# EAGLE design controller (EAGLE 9.6.2)
AUTHOR: Douglas Hutchings; REVISION: C
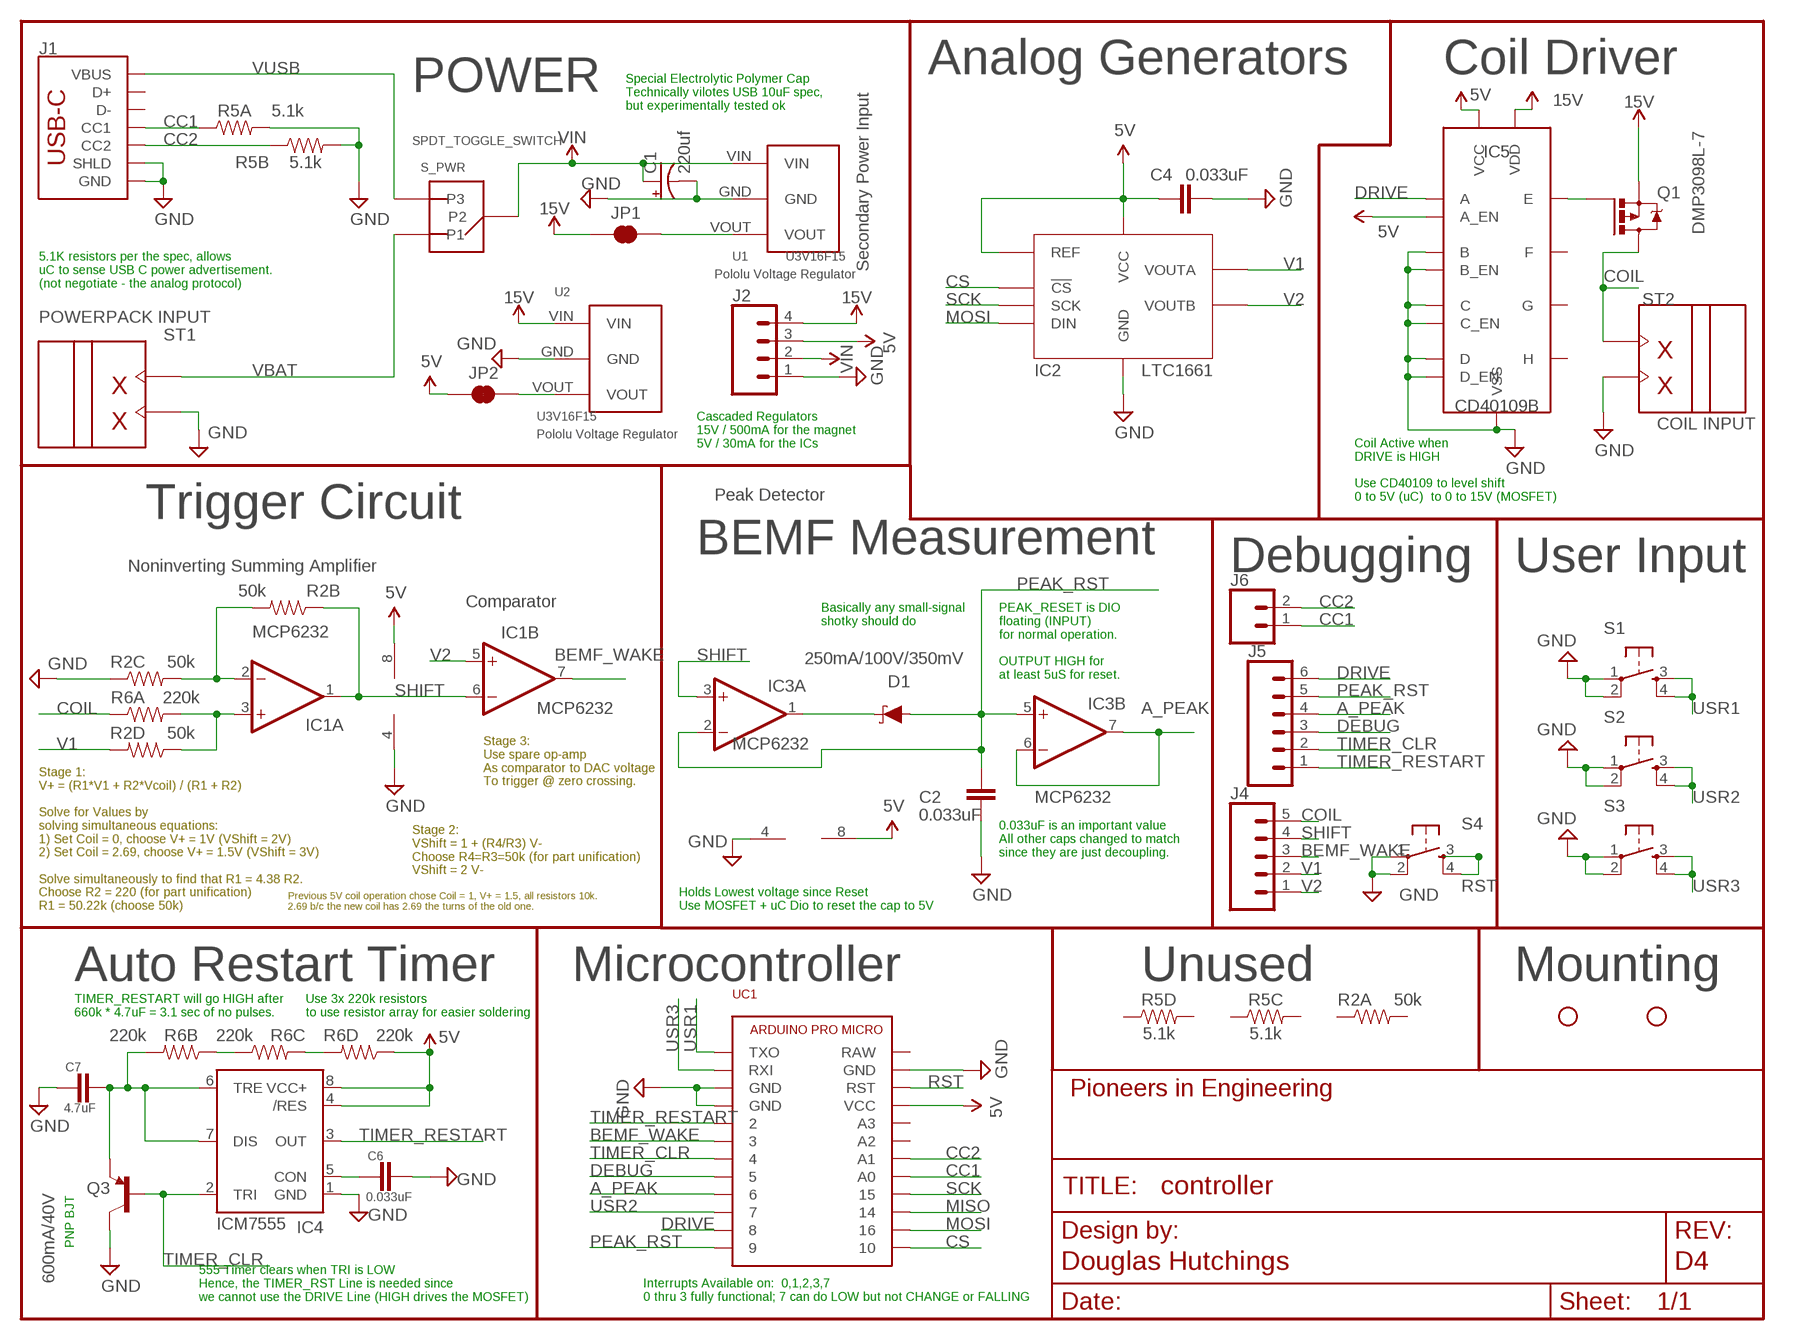
[diagram p0: schematic, sheet 1]
FRAME1 (FRAME_SCHEMATIC): REVISION: D4

## Parts
C1  220uf  CPOL-USE2.5-7  [E2,5-7]
C2  0.033uF  CAP0603-CAP  [0603-CAP]
C4  0.033uF  CAP0603-CAP  [0603-CAP]
C6  0.033uF  CAP0603-CAP  [0603-CAP]
C7  4.7uF  CAP0603-CAP  [0603-CAP]
D1  250mA/100V/350mV  DIODE-SCHOTTKY-BAT60A  [SOD-323]
IC1  MCP6232  MCP602SN  [SO08]
IC2  LTC1661MSOP8  [SOP65P490X110-8N]
IC3  MCP6232  MCP602SN  [SO08]
IC4  ICM7555  555D  [SO08]
IC5  CD40109B  CD40109BTSSOP16  [SOP65P640X120-16N]
J1  USB_C_2-LAYER_PADS  [USB-C-16P-2LAYER-PADS]
J2  CONN_041X04_NO_SILK  [1X04_NO_SILK]
J4  CONN_05NO_SILK  [1X05_NO_SILK]
J5  CONN_06NO_SILK_NO_POP  [1X06_NO_SILK]
J6  CONN_021X02_NO_SILK  [1X02_NO_SILK]
JP1  JUMPER-SMT_2_NC_TRACE_SILK  [SMT-JUMPER_2_NC_TRACE_SILK]
JP2  JUMPER-SMT_2_NC_TRACE_SILK  [SMT-JUMPER_2_NC_TRACE_SILK]
Q1  DMP3098  P-CHANNEL-MOSFETSOT23-3  [SOT23-3]
Q3  600mA/40V  TRANS_PNP-MMBT4403  [SOT23-3]
R2  50k  RESISTOR_ARRAY_(4)-1206-1/16W-5%  [1206_RA]
R5  5.1k  RESISTOR_ARRAY_(4)-1206-1/16W-5%  [1206_RA]
R6  220k  RESISTOR_ARRAY_(4)-1206-1/16W-5%  [1206_RA]
S1  TAC_SWITCHPTH  [TACTILE-PTH]
S2  TAC_SWITCHPTH  [TACTILE-PTH]
S3  TAC_SWITCHPTH  [TACTILE-PTH]
S4  TAC_SWITCHPTH  [TACTILE-PTH]
S_PWR  SPDT_TOGGLE_SWITCH  [E-SWITCH-SPDT]
ST1  2PIN_SCREW  [2PIN_SCREW]
ST2  2PIN_SCREW  [2PIN_SCREW]
STANDOFF1  STAND-OFFKEYSTONE_SMT_STANDOFF  [KEYSTONE-4881]
STANDOFF2  STAND-OFFKEYSTONE_SMT_STANDOFF  [KEYSTONE-4881]
U1  U3V16F15  POLOLU_VOLTAGE_REGULATOR_3PINBOOST  [POLOLU_VOLTAG_REGULATOR_U3V16FX_VERT]
U2  U3V16F15  POLOLU_VOLTAGE_REGULATOR_3PIN  [POLOLU_VOLTAG_REGULATOR_D45V1E1FX_VERT]
UC1  ARDUINO_PRO_MICROUSBC  [ARDUINO_PRO_MICRO_USBC]

## Nets
5V: C4.1 IC1.8(P:V+) IC2.4(REF) IC2.6(VCC) IC3.8(P:V+) IC4.4(/RES) IC4.8(VCC+) IC5.1(VCC) IC5.2(A_EN) J2.3 JP2.1 R6.P4 UC1.VCC
15V: IC5.16(VDD) J2.4 JP1.1 Q1.2(S) U2.VIN
A_PEAK: IC3.6(B:-IN) IC3.7(B:OUT) J5.4 UC1.6
BEMF_WAKE: IC1.7(B:OUT) J4.3 UC1.3
CC1: J1.A5(CC1) J6.1 R5.P1 UC1.A0
CC2: J1.B5(CC2) J6.2 R5.P2 UC1.A1
COIL: J4.5 Q1.3(D) R6.P1 ST2.P$2
CS: IC2.1(!CS) UC1.10
DEBUG: J5.3 UC1.5
DRIVE: IC5.3(A) J5.6 UC1.8
GND: C1.- C2.2 C4.2 C6.2 C7.1 IC1.4(P:V-) IC2.7(GND) IC3.4(P:V-) IC4.1(GND) IC5.6(B) IC5.7(B_EN) IC5.8(VSS) IC5.9(C_EN) IC5.10(C) IC5.14(D) IC5.15(D_EN) J1.GND J1.GND2(GND) J1.SHLD1(SHLD) J1.SHLD2(SHLD) J1.SHLD3(SHLD) J1.SHLD4(SHLD) J2.1 Q3.3(C) R2.P3 R5.P7 R5.P8 S1.1 S1.2 S2.1 S2.2 S3.1 S3.2 S4.1 S4.2 ST1.P$1 ST2.P$1 U1.GND U2.GND UC1.GND@0(GND) UC1.GND@1(GND) UC1.GND@2(GND)
MISO: UC1.14
MOSI: IC2.3(DIN) UC1.16
N$1: D1.C IC3.1(A:OUT)
N$3: R6.P2 R6.P3
N$4: IC1.3(A:+IN) R2.P4 R6.P8
N$5: IC1.2(A:-IN) R2.P6 R2.P7
N$6: C6.1 IC4.5(CON)
N$7: C7.2 IC4.6(TRE) IC4.7(DIS) Q3.2(E) R6.P7
N$8: JP1.2 U1.VOUT
N$9: JP2.2 U2.VOUT
N$10: R6.P5 R6.P6
N$11: IC5.4(E) Q1.1(G)
PEAK_RST: C2.1 D1.A IC3.2(A:-IN) IC3.5(B:+IN) J5.5 UC1.9
RST: S4.3 S4.4 UC1.RST
SCK: IC2.2(SCK) UC1.15
SHIFT: IC1.1(A:OUT) IC1.6(B:-IN) IC3.3(A:+IN) J4.4 R2.P2
TIMER_CLR: IC4.2(TRI) J5.2 Q3.1(B) UC1.4
TIMER_RESTART: IC4.3(OUT) J5.1 UC1.2
USR1: S1.3 S1.4 UC1.TXO
USR2: S2.3 S2.4 UC1.7
USR3: S3.3 S3.4 UC1.RXI
V1: IC2.8(VOUTA) J4.2 R2.P5
V2: IC1.5(B:+IN) IC2.5(VOUTB) J4.1
VBAT: S_PWR.P1 ST1.P$2
VIN: C1.+ J2.2 S_PWR.P2 U1.VIN
VUSB: J1.VBUS1(VBUS) J1.VBUS2(VBUS) S_PWR.P3
Unconnected: IC5.5(F) IC5.11(G) IC5.13(H) J1.A6(D+) J1.A7(D-) J1.B6(D+) J1.B7(D-) R2.P1 R2.P8 R5.P3 R5.P4 R5.P5 R5.P6 UC1.A2 UC1.A3 UC1.RAW

## Notes on the sheet
- Analog Generators | Coil Driver
- POWER | Secondary Power Input
- Special Electrolytic Polymer Cap
  Technically vilotes USB 10uF spec,
  but experimentally tested ok
- DMP3098L-7
- 5.1K resistors per the spec, allows
  uC to sense USB C power advertisement.
  (not negotiate - the analog protocol)
- POWERPACK INPUT
- COIL INPUT
- Cascaded Regulators
  15V / 500mA for the magnet
  5V / 30mA for the ICs
- Peak Detector
- Coil Active when
  DRIVE is HIGH
  
  Use CD40109 to level shift
  0 to 5V (uC)  to 0 to 15V (MOSFET)
- Trigger Circuit
- BEMF Measurement
- Noninverting Summing Amplifier | Debugging | User Input
- Comparator
- Basically any small-signal
  shotky should do
- PEAK_RESET is DIO
  floating (INPUT) 
  for normal operation.
  
  OUTPUT HIGH for
  at least 5uS for reset.
- Stage 3:
  Use spare op-amp
  As comparator to DAC voltage
  To trigger @ zero crossing.
- 0.033uF is an important value
  All other caps changed to match
  since they are just decoupling.
- Stage 2:
  VShift = 1 + (R4/R3) V- 
  Choose R4=R3=50k (for part unification)
  VShift = 2 V-
- Stage 1:
  V+ = (R1*V1 + R2*Vcoil) / (R1 + R2)
  
  Solve for Values by
  solving simultaneous equations:
  1) Set Coil = 0, choose V+ = 1V (VShift = 2V)
  2) Set Coil = 2.69, choose V+ = 1.5V (VShift = 3V)
  
  Solve simultaneously to find that R1 = 4.38 R2.
  Choose R2 = 220 (for part unification)
  R1 = 50.22k (choose 50k)
- Previous 5V coil operation chose Coil = 1, V+ = 1.5, all resistors 10k.
  2.69 b/c the new coil has 2.69 the turns of the old one.
- Holds Lowest voltage since Reset
  Use MOSFET + uC Dio to reset the cap to 5V
- Auto Restart Timer | Microcontroller | Unused | Mounting
- TIMER_RESTART will go HIGH after
  660k * 4.7uF = 3.1 sec of no pulses.
- Use 3x 220k resistors
  to use resistor array for easier soldering
- PNP BJT
- 555 Timer clears when TRI is LOW
  Hence, the TIMER_RST Line is needed since
  we cannot use the DRIVE Line (HIGH drives the MOSFET)
- Interrupts Available on:  0,1,2,3,7
  0 thru 3 fully functional; 7 can do LOW but not CHANGE or FALLING

## Library data of the parts
C1 = rcl:CPOL-US: POLARIZED CAPACITOR, American symbol; SPICEPREFIX: C
C2 C4 = pie:CAP: Capacitor Standard 0603 ceramic capacitor, and 0.1" leaded capacitor.; PIE-INT-REF-NUM: CAPACITOR-GENERIC
C6 C7 = BEST_Custom:CAP: Capacitor Standard 0603 ceramic capacitor, and 0.1" leaded capacitor.; PIE-INT-REF-NUM: CAPACITOR-GENERIC
D1 = SparkFun-DiscreteSemi:DIODE-SCHOTTKY: Schottky diode A Schottky diode is a semiconductor diode which has a low forward voltage drop and a very fast switching action.; PROD_ID: DIO-14072; VALUE: 3A/10V/280mV
IC1 IC3 = BEST_Custom:MCP602: Single Op Amp 2.7V to 6.0V Single Supply CMOS Source: http://ww1.microchip.com/downloads/en/DeviceDoc/21314g.pdf
IC2 = BEST_Custom:LTC1661: Micropower Dual 10-Bit DAC
IC4 = SparkFun-IC-Special-Function:555: General purpose bipolar Timer Datasheet <http://www.sparkfun.com/datasheets/Components/General/ne555.pdf> SparkFun Products SparkFun SparkPunk Sequencer Kit <https://www.sparkfun.com/products/12707> (KIT-12707) Storefront Component: 555 Timer <https://www.sparkfun.com/products/9273> (COM-09273) Two parts valid for production: VFP: IC-11930 (M7555 PTH) VFP: IC-09173 (555 PTH) - Preferred; PROD_ID: NA-XXXXX; VALUE: 555
IC5 = BEST_Custom:CD40109B: CMOS Quad Low-to-High Voltage Level Shifter From TI
J1 = BEST_Custom:USB_C: USB Type C 16Pin Connector Super Speed pins not available on the 16-pin purely SMD connector so this part is best for USB 2.0 implementations. D1 and D2 are tied together enabling D+/- no matter which way the cable is plugged into the connector. The two channel configuration pins (CC1/2) are exposed. These are normally connected to ground via 5.1k resistors but can be reconfigured for high current/high power applications. **4-LAYER BOARD WARNING!!** If designing 4-layer board, make sure to select the variant _4-LAYER-ISOLATED. The linked footprint (USB-C-16-4LAYER-ISOLATED) includes some very necessary cutout polygons in the inner layers (2 and 15). This prevents the PTH mounting shield legs on the USB connector from electrically connecting any other polygons on the inner layers (usually VCC and GND).; PROD_ID: CONN-14122
J2 = SparkFun-Connectors:CONN_04: Multi connection point. Often used as Generic Header-pin footprint for 0.1 inch spaced/style header connections On any of the 0.1 inch spaced packages, you can populate with these: Break Away Headers - Straight <https://www.sparkfun.com/products/116> (PRT-00116) Break Away Male Headers - Right Angle <https://www.sparkfun.com/products/553> (PRT-00553) Female Headers <https://www.sparkfun.com/products/115> (PRT-00115) Break Away Headers - Machine Pin <https://www.sparkfun.com/products/117> (PRT-00117) Break Away Female Headers - Swiss Machine Pin <https://www.sparkfun.com/products/743> (PRT-00743) For SCREWTERMINALS and SPRING TERMINALS visit here: Screw Terimnals on SparkFun.com <https://www.sparkfun.com/search/results?term=Screw+Terminals> (5mm/3.5mm/2.54mm spacing) This device is also useful as a general connection point to wire up your design to another part of your project. Our various solder wires solder well into these plated through hole pads. Hook-Up Wire - Assortment (Stranded, 22 AWG) <https://www.sparkfun.com/products/11375> (PRT-11375) Hook-Up Wire - Assortment (Solid Core, 22 AWG) <https://www.sparkfun.com/products/11367> (PRT-11367) View the entire wire category on our website here <https://www.sparkfun.com/categories/141> Special notes: Molex polarized connector foot print use with SKU : PRT-08231 with associated crimp pins and housings. 1MM SMD Version SKU: PRT-10208; PROD_ID: CONN-09696
J4 = SparkFun-Connectors:CONN_05: Multi connection point. Often used as Generic Header-pin footprint for 0.1 inch spaced/style header connections On any of the 0.1 inch spaced packages, you can populate with these: Break Away Headers - Straight <https://www.sparkfun.com/products/116> (PRT-00116) Break Away Male Headers - Right Angle <https://www.sparkfun.com/products/553> (PRT-00553) Female Headers <https://www.sparkfun.com/products/115> (PRT-00115) Break Away Headers - Machine Pin <https://www.sparkfun.com/products/117> (PRT-00117) Break Away Female Headers - Swiss Machine Pin <https://www.sparkfun.com/products/743> (PRT-00743) For SCREWTERMINALS and SPRING TERMINALS visit here: Screw Terimnals on SparkFun.com <https://www.sparkfun.com/search/results?term=Screw+Terminals> (5mm/3.5mm/2.54mm spacing) This device is also useful as a general connection point to wire up your design to another part of your project. Our various solder wires solder well into these plated through hole pads. Hook-Up Wire - Assortment (Stranded, 22 AWG) <https://www.sparkfun.com/products/11375> (PRT-11375) Hook-Up Wire - Assortment (Solid Core, 22 AWG) <https://www.sparkfun.com/products/11367> (PRT-11367) View the entire wire category on our website here <https://www.sparkfun.com/categories/141> Special notes: Molex polarized connector foot print use with SKU : PRT-08231 with associated crimp pins and housings. 1MM SMD Version SKU: PRT-10208
J5 = SparkFun-Connectors:CONN_06: Multi connection point. Often used as Generic Header-pin footprint for 0.1 inch spaced/style header connections On any of the 0.1 inch spaced packages, you can populate with these: Break Away Headers - Straight <https://www.sparkfun.com/products/116> (PRT-00116) Break Away Male Headers - Right Angle <https://www.sparkfun.com/products/553> (PRT-00553) Female Headers <https://www.sparkfun.com/products/115> (PRT-00115) Break Away Headers - Machine Pin <https://www.sparkfun.com/products/117> (PRT-00117) Break Away Female Headers - Swiss Machine Pin <https://www.sparkfun.com/products/743> (PRT-00743) Arduino Stackable Header - 6 Pin <https://www.sparkfun.com/products/9280> (PRT-09280) Screw Terminals 2.54mm Pitch (6-Pin) <https://www.sparkfun.com/products/16499> (PRT-16499) For SCREWTERMINALS and SPRING TERMINALS visit here: Screw Terimnals on SparkFun.com <https://www.sparkfun.com/search/results?term=Screw+Terminals> (5mm/3.5mm/2.54mm spacing) This device is also useful as a general connection point to wire up your design to another part of your project. Our various solder wires solder well into these plated through hole pads. Hook-Up Wire - Assortment (Stranded, 22 AWG) <https://www.sparkfun.com/products/11375> (PRT-11375) Hook-Up Wire - Assortment (Solid Core, 22 AWG) <https://www.sparkfun.com/products/11367> (PRT-11367) View the entire wire category on our website here <https://www.sparkfun.com/categories/141>
J6 = SparkFun-Connectors:CONN_02: Multi connection point. Often used as Generic Header-pin footprint for 0.1 inch spaced/style header connections On any of the 0.1 inch spaced packages, you can populate with these: Break Away Headers - Straight <https://www.sparkfun.com/products/116> (PRT-00116) Break Away Male Headers - Right Angle <https://www.sparkfun.com/products/553> (PRT-00553) Female Headers <https://www.sparkfun.com/products/115> (PRT-00115) Break Away Headers - Machine Pin <https://www.sparkfun.com/products/117> (PRT-00117) Break Away Female Headers - Swiss Machine Pin <https://www.sparkfun.com/products/743> (PRT-00743) For SCREWTERMINALS and SPRING TERMINALS visit here: Screw Terimnals on SparkFun.com <https://www.sparkfun.com/search/results?term=Screw+Terminals> (5mm/3.5mm/2.54mm spacing) This device is also useful as a general connection point to wire up your design to another part of your project. Our various solder wires solder well into these plated through hole pads. Hook-Up Wire - Assortment (Stranded, 22 AWG) <https://www.sparkfun.com/products/11375> (PRT-11375) Hook-Up Wire - Assortment (Solid Core, 22 AWG) <https://www.sparkfun.com/products/11367> (PRT-11367) View the entire wire category on our website here <https://www.sparkfun.com/categories/141> Special notes: Molex polarized connector foot print use with: PRT-08233 with associated crimp pins and housings. 2.54_SCREWTERM for use with PRT-10571. 3.5mm Screw Terminal footprints for PRT-08084 5mm Screw Terminal footprints for use with PRT-08432
JP1 JP2 = SparkFun-Jumpers:JUMPER-SMT_2_NC_TRACE: Normally closed trace jumper This jumper has a trace between two pads so it's normally closed (NC). Use a razor knife to open the connection. For best results follow the IPC guidelines for cutting traces: Cutout at least 0.063 mm (0.005 in). Remove all loose material to clean up the cut area. Seal the cut with an approved epoxy. Reapply solder to reclose the connection.
Q1 = BEST_Custom:P-CHANNEL-MOSFET: P-Channel PowerTrench® MOSFET Source: FDD4141.pdf; PIE-DIGIKEY-PN-PRI: IRLML6402PBFCT-ND; PIE-INT-REF-NUM: PMOS
Q3 = SparkFun-DiscreteSemi:TRANS_PNP: PNP transistor Current controlled devices typically used to amplify current or used as a switch. SparkFun Products: SparkFun Serial Enabled 16x2 LCD - Red on Black <https://www.sparkfun.com/products/9068> SparkFun Logomatic <https://www.sparkfun.com/products/12772>; PROD_ID: TRANS-09245
R2 R5 R6 = BEST_Custom:RESISTOR_ARRAY_(4): EXB-38V XXX JV Four Resistory Array - AEC-Q200 Certified Panasonic 1206 Resistor Array (Panasonic EXB-38V105JV or similar, perhaps Bourns CAY16-512J4LF too) Each resistor is approximate footprint size larger than 0402 but not as big as as 0603 even though datasheet says it replicates 0603 (metric / imperial?) Yaego 2012 Resistor Array (YC324-JK-07100KL or similar) Each resistor is approximate footprint pitch of 0603, but is longer. It is possible to solder 0603 here.
S1-S4 = BEST_Custom:TAC_SWITCH: Momentary Switch Button commonly used for reset or general input. Spark Fun Electronics SKU : COM-00097; PIE-INT-REF-NUM: pth_pushbutton
S_PWR = BEST_Custom:SPDT_TOGGLE_SWITCH: Toggle Switch SPDT Panel Mount digikey: EG2377-ND
ST1 ST2 = BEST_Custom:2PIN_SCREW: 2 Pin Screw Terminal Sparkfun Page <https://www.sparkfun.com/products/8432> 5mm Pitch
STANDOFF1 STANDOFF2 = BEST_Custom:STAND-OFF: #4 Stand Off This is the mechanical footprint for a #4 phillips button head screw. Use the keepout ring to avoid running the screw head into surrounding components. SKU : PRT-00447 Keystone has a fancy smt solder-in standoff that can be used essentially as a solder-in nut: 36-4881CT-ND
U1 U2 = BEST_Custom:POLOLU_VOLTAGE_REGULATOR_3PIN
UC1 = BEST_Custom:ARDUINO_PRO_MICRO: Arduino Pro Micro Electrical System Year 9's Smart Sensor Core Pin Outs <https://cdn.sparkfun.com/assets/9/c/3/c/4/523a1765757b7f5c6e8b4567.png> Buy Here <http://www.aliexpress.com/item/Mini-Leonardo-Pro-Micro-ATmega32U4-5V-16MHz-Module-For-Arduino-Best-Quality/32284746884.html?ws_ab_test=searchweb201556_8,searchweb201602_2_10057_10056_10065_10055_10054_10067_10069_10059_10058_10017_10070_10060_10061_10052_10062_10053_10050_10051,searchweb201603_1&btsid=45993952-29ca-4de4-a0fb-c7fb72b8e1a5> Thru Hole Female Pins <http://www.digikey.com/product-search/en?keywords=929974E-01-12-ND> Surface Mount Female Pins <http://www.digikey.com/product-detail/en/sullins-connector-solutions/NPTC121KFXC-RC/S5604-ND/776062>

## Board
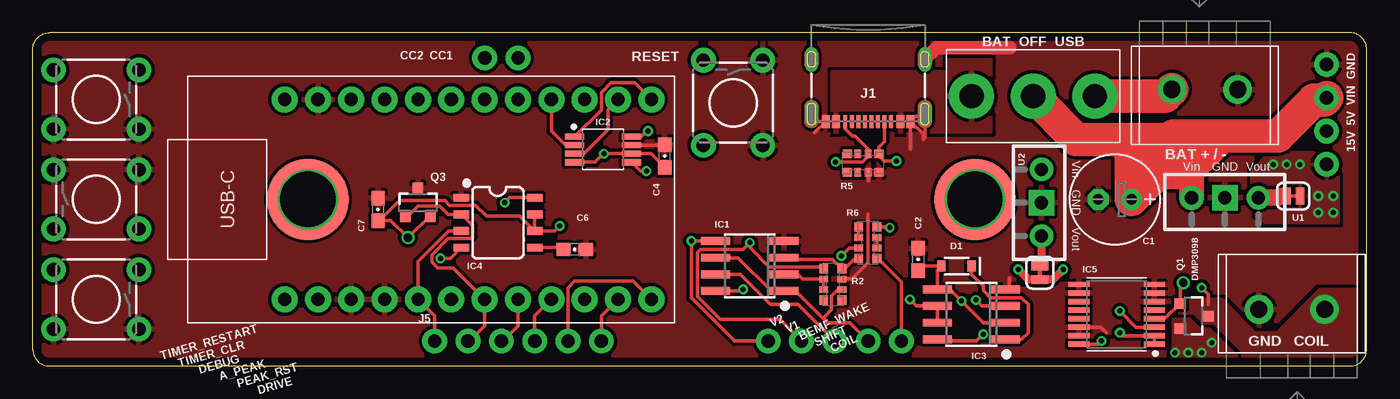
[diagram p1: board, top side]
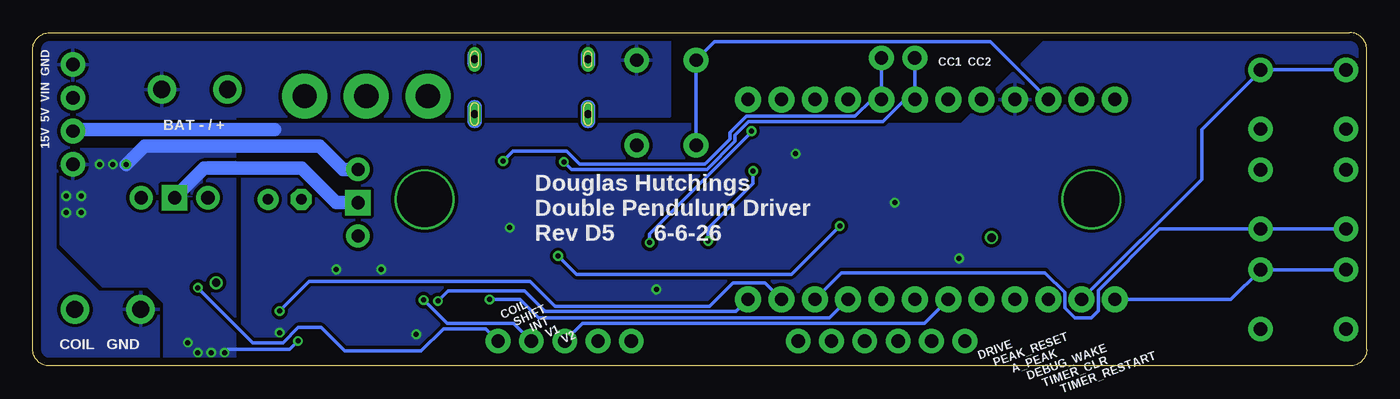
[diagram p2: board, bottom side, seen from below]

Size 101.6 x 25.4 mm. Coordinates in mm from the lower left corner, seen from the top.
Outline: 0,1.27 0,24.13 arc-90 1.27,25.4 100.33,25.4 arc-90 101.6,24.13 101.6,1.27 arc-90 100.33,0 1.27,0 arc-90 0,1.27
Copper layers (1*16): Top 1mil / dielectric 60.5mil / Bottom 1mil
Design rules "pie-BAC *": minimum track width 6mil, minimum drill 15mil, track to track 6mil, track to pad 6mil, pad to pad 6mil, via to via 6mil, smd to smd 6mil, copper to edge 25mil, drill to drill 7mil, minimum pad ring 7mil, minimum via ring 7mil, stop-mask expansion 3mil, vias tented up to drill 21mil, thermal gap 10mil

### Footprints (pad centres in the part's own frame; a part is rotated, then mirrored left to right if it is on the bottom)
E2,5-7 = drill 0.813 pad 1.6: + -1.27,0 | drill 0.813 pad 1.6 octagon: - 1.27,0
0603-CAP = smd 1.1 x 1: 1 -0.85,0; 2 0.85,0
SOD-323 = smd 0.63 x 0.83: A 1.15,0; C -1.15,0
SO08 = smd 0.6 x 2.2: 1 -1.905,-2.6; 2 -0.635,-2.6; 3 0.635,-2.6; 4 1.905,-2.6; 5 1.905,2.6; 6 0.635,2.6; 7 -0.635,2.6; 8 -1.905,2.6
SOP65P490X110-8N = smd 1.451 x 0.475: 1 -2.16,0.975; 2 -2.16,0.325; 3 -2.16,-0.325; 4 -2.16,-0.975; 5 2.16,-0.975; 6 2.16,-0.325; 7 2.16,0.325; 8 2.16,0.975
SO08' = smd 0.6 x 1.2: 1 -1.905,-2.8; 2 -0.635,-2.8; 3 0.635,-2.8; 4 1.905,-2.8; 5 1.905,2.8; 6 0.635,2.8; 7 -0.635,2.8; 8 -1.905,2.8
SOP65P640X120-16N = smd 1.572 x 0.402: 1 -2.872,2.275; 2 -2.872,1.625; 3 -2.872,0.975; 4 -2.872,0.325; 5 -2.872,-0.325; 6 -2.872,-0.975; 7 -2.872,-1.625; 8 -2.872,-2.275; 9 2.872,-2.275; 10 2.872,-1.625; 11 2.872,-0.975; 12 2.872,-0.325; 13 2.872,0.325; 14 2.872,0.975; 15 2.872,1.625; 16 2.872,2.275
USB-C-16P-2LAYER-PADS = smd 0.3 x 1: A5 -1.25,-0.34; A6 -0.25,-0.34; A7 0.25,-0.34; A8 1.25,-0.34; B5 1.75,-0.34; B6 0.75,-0.34; B7 -0.75,-0.34; B8 -1.75,-0.34 | smd 0.6 x 1: GND -3.225,-0.34; GND2 3.225,-0.34; VBUS1 -2.45,-0.34; VBUS2 2.45,-0.34 | drill 0.6 pad 0.8 long: SHLD1 -4.318,-0.915; SHLD2 4.318,-0.915; SHLD3 -4.318,-5.095; SHLD4 4.318,-5.095
1X04_NO_SILK = drill 1.016 pad 1.88: 1 0,0; 2 2.54,0; 3 5.08,0; 4 7.62,0
1X05_NO_SILK = drill 1.016 pad 1.88: 1 0,0; 2 2.54,0; 3 5.08,0; 4 7.62,0; 5 10.16,0
1X06_NO_SILK = drill 1.016 pad 1.88: 1 0,0; 2 2.54,0; 3 5.08,0; 4 7.62,0; 5 10.16,0; 6 12.7,0
1X02_NO_SILK = drill 1.016 pad 1.88: 1 0,0; 2 2.54,0
SMT-JUMPER_2_NC_TRACE_SILK = smd 0.66 x 1.27: 1 -0.521,0; 2 0.521,0
SOT23-3 = smd 0.8 x 0.9: 1 -0.95,-1; 2 0.95,-1; 3 0,1.1
1206_RA = smd 0.7 x 0.65: P1 -1.2,-0.67; P4 1.2,-0.67; P5 1.2,0.73; P8 -1.2,0.73 | smd 0.5 x 0.65: P2 -0.4,-0.67; P3 0.4,-0.67; P6 0.4,0.73; P7 -0.4,0.73
TACTILE-PTH = drill 1.016 pad 1.88: 1 -3.251,2.261; 2 3.251,2.261; 3 -3.251,-2.261; 4 3.251,-2.261
E-SWITCH-SPDT = drill 1.854 pad 3.429: P1 -4.699,0; P2 0,0; P3 4.699,0
2PIN_SCREW = drill 1.3 pad 2.184: P$1 3.1,3.3; P$2 8.1,3.3
KEYSTONE-4881 = drill 4.216 pad 4.216: P$1 0,0 | smd 6.198 x 6.198: P$2 0,0
POLOLU_VOLTAG_REGULATOR_U3V16FX_VERT = drill 1 pad 1.93 square: GND 0,0 | drill 1 pad 1.778: VIN -2.54,0; VOUT 2.54,0
POLOLU_VOLTAG_REGULATOR_D45V1E1FX_VERT = drill 1 pad 1.93 square: GND 0,0 | drill 1 pad 1.778: VIN -2.54,0; VOUT 2.54,0
ARDUINO_PRO_MICRO_USBC = drill 1 pad 1.981: 2 -7.62,3.81; 3 -7.62,1.27; 4 -7.62,-1.27; 5 -7.62,-3.81; 6 -7.62,-6.35; 7 -7.62,-8.89; 8 -7.62,-11.43; 9 -7.62,-13.97; 10 7.62,-13.97; 14 7.62,-8.89; 15 7.62,-6.35; 16 7.62,-11.43; A0 7.62,-3.81; A1 7.62,-1.27; A2 7.62,1.27; A3 7.62,3.81; GND@0 -7.62,8.89; GND@1 -7.62,6.35; GND@2 7.62,11.43; RAW 7.62,13.97; RST 7.62,8.89; RXI -7.62,11.43; TXO -7.62,13.97; VCC 7.62,6.35

### Placement (x,y rotation side)
C1  82.42,12.7 180 top
C2  67.44,8.13 90 top
C4  48.13,16 90 top
C6  41.27,8.89 0 top
C7  26.29,11.94 270 top
D1  70.36,7.62 180 top
IC1  54.61,7.62 90 top
IC2  43.43,16.51 0 top
IC3  71.5,3.94 90 top
IC4  ICM7555  [SO08']  35.43,10.92 270 top
IC5  82.55,3.94 180 top
J1  63.63,18.29 180 top
J2  98.55,22.99 270 top
J4  56.01,1.91 0 top
J5  30.61,1.91 0 top
J6  36.96,23.5 180 top
JP1  96.01,12.95 180 top
JP2  76.71,7.11 90 top
Q1  88.39,3.81 270 top
Q3  29.34,12.45 0 top
R2  60.96,6.22 90 top
R5  63.25,15.49 180 top
R6  63.63,9.4 90 top
S1  4.83,5.08 180 top
S2  4.83,12.7 0 top
S3  4.83,20.32 180 top
S4  53.34,20.07 270 top
S_PWR  76.2,20.57 180 top
ST1  94.87,24.38 180 top
ST2  90.3,1.02 0 top
STANDOFF1  20.95,12.7 0 top
STANDOFF2  71.75,12.7 0 top
U1  90.81,12.83 0 top
U2  76.83,12.45 270 top
UC1  33.15,12.7 90 top

### Tracks (layer width: path | path; a pad name or v marks a point on that pad's centre or on a via)
5V  (via drill 0.38)
  Top 0.254: v31.05,8.19 31.81,8.19 IC4.4 | IC4.8 36.32,12.83 v35.94,12.45 | IC1.8 53.98,5.71 v54.1,5.84 | v72.39,2.41 71.88,1.91 69.03,1.91 IC3.8 | IC2.4 42.84,15.54 v43.49,16.18 | v43.49,16.18 IC2.6 47.1,16.18 C4.1 | v43.49,16.18 | R6.P4 65.22,10.6 v65.28,10.54 | IC5.1 IC5.2 83.03,2.31 v82.8,2.54
  Top 0.61: v78.49,7.37 77.71,6.59 JP2.1 75.83,6.59 v75.06,7.37
  Bottom 1.016: J2.3 98.42,18.03 83.19,18.03
  pour Bottom (isolate 0.254): 0.76,24.89 24.38,24.89 30.86,18.41 85.6,18.41 85.6,0.51 0.76,0.51
15V  (via drill 0.38)
  Top 0.254: v81.41,1.91 81.16,1.66 IC5.16
  Bottom 0.254: v87,1.02 86.74,1.27 82.04,1.27 v81.41,1.91
  Bottom 1.016: U2.VIN 77.98,14.99 79.76,16.76 93.09,16.76 v94.49,15.37
  other vias: 88.01,1.02 89.03,1.02 89.79,1.78 97.92,11.68 97.92,12.95 99.06,12.95 99.06,11.68 96.52,15.37 95.5,15.37
  pour Bottom (isolate 0.254): 86.23,16.51 98.17,16.51 99.44,15.24 99.44,9.27 96.27,6.1 92.84,6.1 91.57,4.83 91.57,0.51 86.23,0.51
  pour Top (isolate 0.254): 92.84,11.94 93.85,10.92 99.44,10.92 99.44,15.11 98.3,16.26 94.23,16.26 92.84,14.86
  pour Top (isolate 0.254, no thermals): 86.87,0.51 86.87,3.56 88.14,3.56 88.9,2.79 89.66,2.79 91.95,0.51
A_PEAK  (via drill 0.38)
  Top 0.254: IC3.7 IC3.6 67.31,4.57 v66.81,5.07 | J5.4 38.23,3.81 UC1.6
  Bottom 0.254: UC1.6 40.92,3.66 63.09,3.66 64.5,5.07 v66.81,5.07
BEMF_WAKE
  Top 0.254: IC1.7 53.91,6.99 56.19,4.7 58.29,4.7 J4.3
  Bottom 0.254: J4.3 59.74,3.25 33.71,3.25 UC1.3
CC1  (via drill 0.38)
  Top 0.254: J1.A5 64.88,17.12 64.45,16.69 R5.P1 64.45,15.99 64.81,15.62 v65.79,15.62
  Bottom 0.254: v65.79,15.62 65.02,16.38 60.96,16.38 59.97,15.39 50.42,15.39 48.51,17.3 48.51,17.78 47.24,19.05 38.97,19.05 37.7,20.32 UC1.A0 J6.1
CC2  (via drill 0.38)
  Top 0.254: v61.15,15.56 63.21,15.56 63.65,15.99 R5.P2 63.65,16.49 62.61,17.53 62.43,17.53 61.88,18.08 J1.B5
  Bottom 0.254: v61.15,15.56 60.58,14.99 50.25,14.99 48.11,17.13 48.11,17.61 47.08,18.64 36.84,18.64 35.16,20.32 UC1.A1 J6.2
COIL  (via drill 0.38)
  Top 0.254: 64.41,8.2 R6.P1 64.37,8.2 66.17,6.4 J4.5 | v89.03,5.97 89.53,5.46 89.53,4.7
  Bottom 0.254: v89.03,5.97 84.84,1.78 82.55,1.78 81.39,2.93 79.64,2.93 77.85,1.14 72.01,1.14 70.31,2.85 67.11,2.85 J4.5
  pour Top (isolate 0.254, rank 2, no thermals): 101.35,0.51 87.25,0.51 87.25,5.08 90.55,5.08 93.09,2.54 94.74,2.54 98.04,5.84 101.35,5.84
CS
  Top 0.254: UC1.10 45.85,21.59 44.05,21.59 43.31,20.85 43.31,19.52 IC2.1
DEBUG
  Top 0.254: UC1.5 36.96,3.05 35.81,1.91 J5.3
DRIVE  (via drill 0.38)
  Top 0.254: J5.6 43.31,3.81 UC1.8 | IC5.3 84.03,2.96 v82.8,4.19
  Bottom 0.254: UC1.8 45.85,6.35 48.26,6.35 50.05,4.56 61.84,4.56 63.72,6.44 80.56,6.44 v82.8,4.19
GND
  Top 0.254: J1.SHLD2 59.88,18.63 J1.GND2 59.55,17.78 | J1.SHLD1 67.94,19.05 | 67.94,19.05 67.94,17.4 67.82,17.27 67.82,17.66 J1.GND | 66.85,16.55 J1.GND | IC3.4 74.37,6.11 74.37,6.71 | J1.GND 67.27,19.05 67.94,19.05 | R5.P7 63.65,14.12 | IC2.7 48.12,16.84 C4.2 | IC5.14 81.37,2.96 81.79,2.54 | 63.63,11.56 63.63,7.86 62.39,6.62 R2.P3
  Top 1.016: J1.SHLD3 68.82,24.26 74.42,24.26
  Bottom 1.016: U2.GND 78.49,12.45 81.13,15.09 88.54,15.09 U1.GND
  pour Top (isolate 0.254, rank 3): 0.76,24.89 69.22,24.89 69.22,22.73 60.33,22.73 60.33,17.65 73.28,17.65 73.28,24.89 101.35,24.89 101.35,0.51 0.76,0.51
  pour Bottom (isolate 0.254, rank 2): 53.09,24.89 101.35,24.89 101.35,0.51 86.23,0.51 86.23,19.05 53.09,19.05
MOSI
  Top 0.254: UC1.16 43.81,19.56 43.81,18.02 41.98,16.18 IC2.3
N$1
  Top 0.254: D1.C 71.51,6.99 72.39,6.1 72.39,5.76 72.94,5.21 75.31,5.21 75.82,4.7 75.82,2.54 75.31,2.03 IC3.1
N$3
  Top 0.254: R6.P2 R6.P3
N$4
  Top 0.254: IC1.3 57.34,8.13 60.92,8.13 R2.P4 61.63,7.22 62.61,8.2 R6.P8
N$5
  Top 0.254: IC1.2 58.27,6.99 58.63,6.62 R2.P6 R2.P7
N$6
  Top 0.254: IC4.5 40.3,9.02 C6.1
N$7  (via drill 0.38, 0.64)
  Top 0.254: IC4.6 IC4.7 | Q3.2 30.24,11.45 v28.57,9.78 27.27,11.09 26.42,11.09 | C7.2 26.42,11.09 | IC4.6 37.09,11.43 34.54,11.43 33.73,12.25 31.76,12.25 31.41,12.6 27.93,12.6 26.42,11.09 | IC4.6 39.75,10.29 v40.13,10.67 | R6.P7 62.21,9 | 62.21,9 | v61.59,8.38 62.21,9
  Bottom 0.254: v40.13,10.67 43.81,6.99 60.2,6.99 v61.59,8.38
N$8
  Top 0.61: JP1.2 95,12.95
  Top 1.27: 95,12.95 94.87,12.83 U1.VOUT
N$9
  Top 0.61: U2.VOUT 76.83,7.76 JP2.2
N$10
  Top 0.254: R6.P6 R6.P5
N$11  (via drill 0.64)
  Top 0.254: IC5.4 86.24,3.61 Q1.1 87.39,6.11 v87.63,6.35
PEAK_RST  (via drill 0.38)
  Top 0.254: IC3.2 72.39,3.3 v70.74,4.95 69.85,5.84 IC3.5 68.9,7.31 D1.A 67.78,7.62 C2.1 | J5.5 40.77,5.97 41.27,6.48 45.72,6.48 UC1.9
  Bottom 0.254: UC1.9 48.04,4.15 62.57,4.15 64.14,5.71 69.98,5.71 v70.74,4.95
RST
  Bottom 0.254: S4.4 S4.3 49.68,24.71 28.65,24.71 UC1.RST
SCK
  Top 0.254: UC1.15 39.5,17.9 40.57,16.84 IC2.2
SHIFT  (via drill 0.38)
  Top 0.254: IC1.6 53.72,8.26 56.26,5.71 IC1.1 58.1,5.71 60.29,3.52 | J4.4 62.23,3.3 60.51,3.3 60.29,3.52 | IC3.3 72.29,4.57 v71.83,5.03 | R2.P2 61.32,5.82 60.83,5.33 60.83,4.3 60.29,3.76 60.29,3.52
  Bottom 0.254: J4.4 64.97,3.25 68.15,3.25 70.05,3.25 v71.83,5.03
TIMER_CLR
  Top 0.254: Q3.1 28.59,11.45 29.34,12.19 30.99,12.19 31.62,11.56 IC4.2 32.66,11.56 33.51,10.7 33.51,9.87 33.35,9.71 31.65,9.71 30.4,8.46 30.4,7.93 30.83,7.49 32,7.49 UC1.4 34.42,3.05 33.27,1.91 J5.2
TIMER_RESTART
  Top 0.254: J5.1 30.61,3.81 UC1.2 29.34,7.97 31.65,10.29 IC4.3
USR1
  Bottom 0.254: S1.4 S1.3 10.34,5.08 UC1.TXO
USR2
  Bottom 0.254: S2.3 S2.4 15.78,10.44 20.45,5.78 20.45,4.19 20.95,3.68 22.23,3.68 22.99,4.45 22.99,5.61 24.49,7.11 40.01,7.11 UC1.7
USR3
  Bottom 0.254: S3.4 S3.3 8.08,22.53 12.57,18.03 12.57,14.22 UC1.RXI
V1  (via drill 0.38)
  Top 0.254: J4.2 56.9,3.56 52.37,3.56 50.63,5.3 50.63,8.67 50.85,8.89 54.1,8.89 v54.61,9.4 54.61,9.02 56.06,7.56 60.11,7.56 60.11,7.55 R2.P5 | IC2.8 46.36,17.48 46.78,17.91 v46.86,17.91
  Bottom 0.254: v46.86,17.91 46.81,17.86 46.81,17.85 54.61,10.05 v54.61,9.4
V2  (via drill 0.38)
  Top 0.254: IC1.5 v50.16,9.53 50.16,5.19 53.45,1.91 J4.1 | IC2.5 46.27,14.86 v46.74,14.86
  Bottom 0.254: v50.16,9.53 50.16,10.49 46.74,13.92 v46.74,14.86
VBAT
  Top 2.54: S_PWR.P1 86.26,20.57 ST1.P$2
VIN
  Top 1.905: U1.VIN 88.27,15.24
  Top 2.54: S_PWR.P2 79.5,17.27 83.57,17.27 | J2.2 98.37,20.27 97.57,20.27 94.83,17.53 90.55,17.53 | 90.55,17.53 88.27,15.24 86.23,17.27 83.57,17.27 | C1.+ 83.69,17.14 83.57,17.27 | C1.+ 85.34,14.35 85.34,16.26 | C1.+ 85.72,14.73 87.38,14.73 | 90.55,17.53 86.87,17.53 86.36,17.02
VUSB
  pour Top (isolate 0.254): 60.96,17.91 72.9,17.91 72.9,24.89 69.72,24.89 69.72,22.35 60.96,22.35

### Text on the board
tNames: BAT OFF USB | 15V 5V VIN GND | CC2 CC1 | RESET | BAT + / - | GND COIL | V2 / V1 / BEMF_WAKE / SHIFT / COIL | TIMER_RESTART / TIMER_CLR / DEBUG / A_PEAK / PEAK_RST / DRIVE
bNames: 15V 5V VIN GND | CC1 CC2 | BAT - / + | Douglas Hutchings / Double Pendulum Driver / Rev D5 6-6-26 | COIL GND | COIL / SHIFT / INT / V1 / V2 | DRIVE / PEAK_RESET / A_PEAK / DEBUG_WAKE / TIMER_CLR / TIMER_RESTART
tDocu: NOTE: IF USING OSHPARK: / In the DRC, set "elongation in the shapes tab To 150% / This will ensure that the slots come out correctly!!